# Altium project PCB_Project.PrjPcb
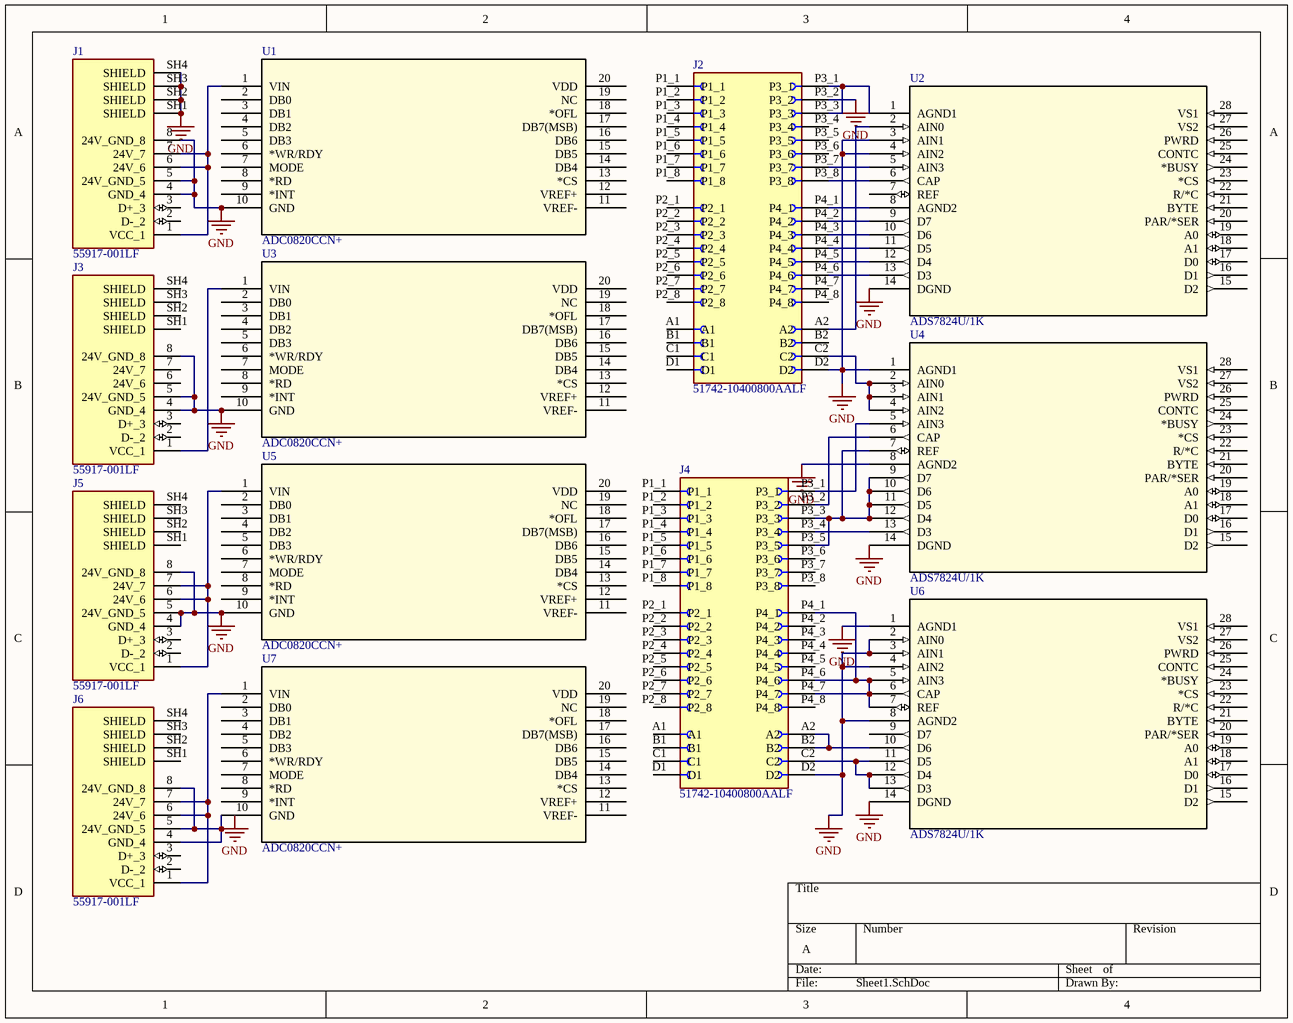
[diagram p0: Sheet1.SchDoc]
1 sheet, 13 parts. Net scope: global (net labels, ports and power ports of the same name join across sheets).
Board file: PCB1.PcbDoc

## Sheet Sheet1.SchDoc
size A; SheetNumber: 1; SheetTotal: 1

### Parts
J1  55917-001LF  [AMPHENOL_55917-001LF]
J2  51742-10400800AALF  [AMPHENOL_51742-10400800AALF]
J3  55917-001LF  [AMPHENOL_55917-001LF]
J4  51742-10400800AALF  [AMPHENOL_51742-10400800AALF]
J5  55917-001LF  [AMPHENOL_55917-001LF]
J6  55917-001LF  [AMPHENOL_55917-001LF]
U1  ADC0820CCN+  [21-0043D_20_MXM]
U2  ADS7824U/1K  [DW28]
U3  ADC0820CCN+  [21-0043D_20_MXM]
U4  ADS7824U/1K  [DW28]
U5  ADC0820CCN+  [21-0043D_20_MXM]
U6  ADS7824U/1K  [DW28]
U7  ADC0820CCN+  [21-0043D_20_MXM]

### Nets
GND: J1.4(GND_4) J1.5(24V_GND_5) J1.8(24V_GND_8) J1.SH1(SHIELD) J1.SH2(SHIELD) J1.SH3(SHIELD) J1.SH4(SHIELD) J2.D2 J2.P3_2 J3.4(GND_4) J3.5(24V_GND_5) J3.8(24V_GND_8) J4.D2 J5.4(GND_4) J5.5(24V_GND_5) J5.8(24V_GND_8) U1.10(GND) U2.3(AIN1) U2.4(AIN2) U2.14(DGND) U3.10(GND) U4.1(AGND1) U4.8(AGND2) U4.14(DGND) U5.10(GND) U6.1(AGND1) U6.2(AIN0) U6.3(AIN1) U6.4(AIN2) U6.8(AGND2) U6.14(DGND)
NetJ1_1: J1.1(VCC_1) J1.6(24V_6) J1.7(24V_7) U1.1(VIN)
NetJ2_A2: J2.A2 U2.2(AIN0)
NetJ2_C2: J2.C2 U4.2(AIN0) U4.3(AIN1) U4.4(AIN2)
NetJ2_P3_1: J2.P3_1 J2.P3_3 U2.1(AGND1)
NetJ2_P3_7: J2.P3_7 U2.5(AIN3)
NetJ2_P3_8: J2.P3_8 U2.6(CAP)
NetJ2_P4_1: J2.P4_1 U2.8(AGND2)
NetJ2_P4_2: J2.P4_2 U2.9(D7)
NetJ2_P4_3: J2.P4_3 U2.10(D6)
NetJ2_P4_4: J2.P4_4 U2.11(D5)
NetJ2_P4_5: J2.P4_5 U2.12(D4)
NetJ2_P4_6: J2.P4_6 U2.13(D3)
NetJ3_1: J3.1(VCC_1) U3.1(VIN)
NetJ4_A2: J4.A2 J4.B2 U6.10(D6)
NetJ4_C2: J4.C2 U6.11(D5) U6.12(D4) U6.13(D3)
NetJ4_P3_1: J4.P3_1 U4.5(AIN3)
NetJ4_P3_2: J4.P3_2 U4.6(CAP)
NetJ4_P3_3: J4.P3_3 J4.P3_5 U4.7(REF) U4.9(D7) U4.10(D6) U4.11(D5) U4.12(D4)
NetJ4_P3_4: J4.P3_4 U4.13(D3)
NetJ4_P4_1: J4.P4_1 J4.P4_6 J4.P4_7 U6.5(AIN3) U6.6(CAP) U6.7(REF)
NetJ5_1: J5.1(VCC_1) J5.6(24V_6) J5.7(24V_7) U5.1(VIN)
NetJ6_1: J6.1(VCC_1) J6.6(24V_6) J6.7(24V_7) U7.1(VIN)
NetJ6_4: J6.4(GND_4) J6.5(24V_GND_5) J6.8(24V_GND_8) U7.10(GND)

Not connected (* = marked no-connect by the designer): J1 2(D-_2) 3(D+_3); J2 A1 B1 B2 C1 D1 P1_1 P1_2 P1_3 P1_4 P1_5 P1_6 P1_7 P1_8 P2_1 P2_2 P2_3 P2_4 P2_5 P2_6 P2_7 P2_8 P3_4 P3_5 P3_6 P4_7 P4_8; J3 2(D-_2) 3(D+_3) 6(24V_6) 7(24V_7) SH1(SHIELD) SH2(SHIELD) SH3(SHIELD) SH4(SHIELD); J4 A1 B1 C1 D1 P1_1 P1_2 P1_3 P1_4 P1_5 P1_6 P1_7 P1_8 P2_1 P2_2 P2_3 P2_4 P2_5 P2_6 P2_7 P2_8 P3_6 P3_7 P3_8 P4_2 P4_3 P4_4 P4_5 P4_8; J5 2(D-_2) 3(D+_3) SH1(SHIELD) SH2(SHIELD) SH3(SHIELD) SH4(SHIELD); J6 2(D-_2) 3(D+_3) SH1(SHIELD) SH2(SHIELD) SH3(SHIELD) SH4(SHIELD); U1 2(DB0) 3(DB1) 4(DB2) 5(DB3) 6(*WR/RDY) 7(MODE) 8(*RD) 9(*INT) 11(VREF-) 12(VREF+) 13(*CS) 14(DB4) 15(DB5) 16(DB6) 17(DB7(MSB)) 18(*OFL) 19(NC) 20(VDD); U2 7(REF) 15(D2) 16(D1) 17(D0) 18(A1) 19(A0) 20(PAR/*SER) 21(BYTE) 22(R/*C) 23(*CS) 24(*BUSY) 25(CONTC) 26(PWRD) 27(VS2) 28(VS1); U3 2(DB0) 3(DB1) 4(DB2) 5(DB3) 6(*WR/RDY) 7(MODE) 8(*RD) 9(*INT) 11(VREF-) 12(VREF+) 13(*CS) 14(DB4) 15(DB5) 16(DB6) 17(DB7(MSB)) 18(*OFL) 19(NC) 20(VDD); U4 15(D2) 16(D1) 17(D0) 18(A1) 19(A0) 20(PAR/*SER) 21(BYTE) 22(R/*C) 23(*CS) 24(*BUSY) 25(CONTC) 26(PWRD) 27(VS2) 28(VS1); U5 2(DB0) 3(DB1) 4(DB2) 5(DB3) 6(*WR/RDY) 7(MODE) 8(*RD) 9(*INT) 11(VREF-) 12(VREF+) 13(*CS) 14(DB4) 15(DB5) 16(DB6) 17(DB7(MSB)) 18(*OFL) 19(NC) 20(VDD); U6 9(D7) 15(D2) 16(D1) 17(D0) 18(A1) 19(A0) 20(PAR/*SER) 21(BYTE) 22(R/*C) 23(*CS) 24(*BUSY) 25(CONTC) 26(PWRD) 27(VS2) 28(VS1); U7 2(DB0) 3(DB1) 4(DB2) 5(DB3) 6(*WR/RDY) 7(MODE) 8(*RD) 9(*INT) 11(VREF-) 12(VREF+) 13(*CS) 14(DB4) 15(DB5) 16(DB6) 17(DB7(MSB)) 18(*OFL) 19(NC) 20(VDD)

### Notes on the sheet
- Labels drawn without touching a wire or pin: GND

### Library data of the parts
J2 J4 = 51742-10400800AALF: PwrBladeÂ®, Power Supply Connectors, 4P 8S Vertical Receptacle.; MF: Amphenol ICC (FCI); Package: None; Price: None; Check_prices: https://www.snapeda.com/parts/51742-10400800AALF/Amphenol+FCI/view-part/?ref=eda; Value: *; SnapEDA_Link: https://www.snapeda.com/parts/51742-10400800AALF/Amphenol+FCI/view-part/?ref=snap; MP: 51742-10400800AALF; Availability: In Stock; Purchase-URL: https://pricing.snapeda.com/search?q=51742-10400800AALF&ref=eda
U1 U3 U5 U7 = ADC0820CCN+: No Description Available; Mfr_Name: Analog Devices Inc; Copyright: Copyright (C) 2023 Ultra Librarian. All rights reserved.; Manufacturer_Part_Number: ADC0820CCN+; RefDes: RefDes; Type: DEV
U2 U4 U6 = ADS7824U1K: No Description Available; Mfr_Name: Texas Instruments; Copyright: Copyright (C) 2023 Ultra Librarian. All rights reserved.; Manufacturer_Part_Number: ADS7824U/1K; RefDes: RefDes; Type: DEV
J1 J3 J5 J6 = 55917-001LF: MP: 55917-001LF; Availability: Unavailable; Value: *; Package: None; Price: None